# Altium schematic sheet MAX_SEG.SchDoc
size A; SheetNumber: 2; SheetTotal: 2
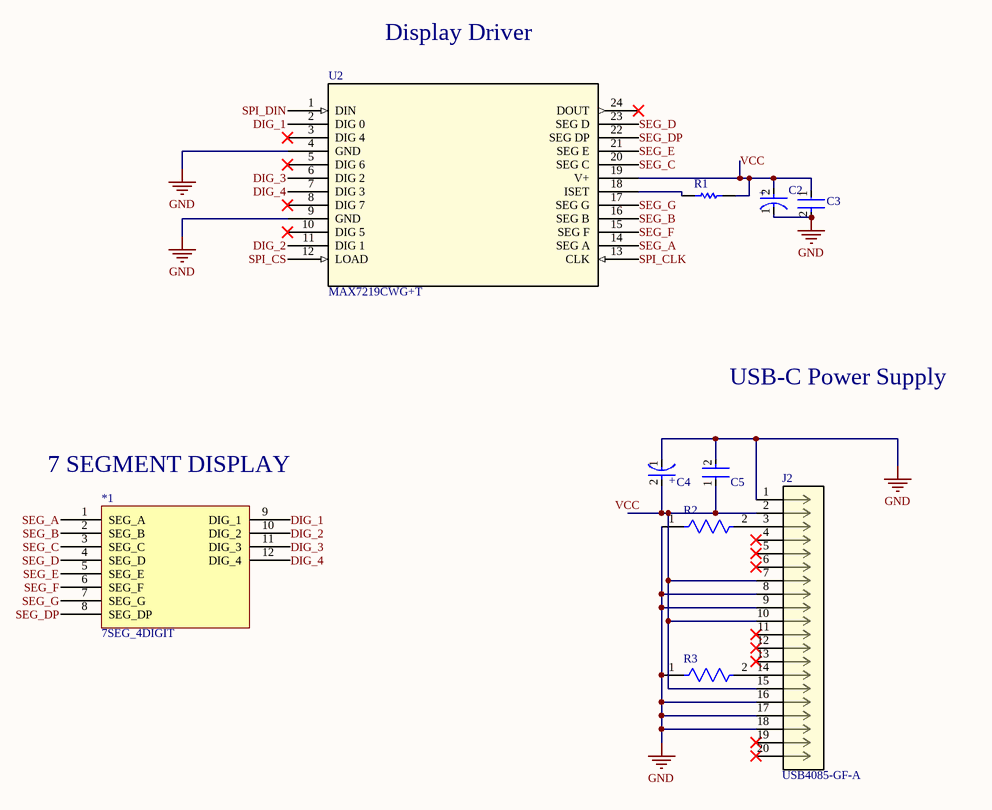
[diagram p0: MAX_SEG.SchDoc]

## Parts
*1  7SEG_4DIGIT  [PCBComponent_1]
C2  TAJB106K010RNJ  [FP-TAJB-MFG]  (value not drawn)
C3  GRM155R71C104KA88D  [FP-GRM15-MFG]  (value not drawn)
C4  TAJB106K010RNJ  [FP-TAJB-MFG]  (value not drawn)
C5  GRM155R71C104KA88D  [FP-GRM15-MFG]  (value not drawn)
J2  USB4085-GF-A  [CONN16_USB4085-GF-A_GCT]
R1  RC0402FR-0710KL  [RESC1005X40X25LL05T10]  (value not drawn)
R2  RN73R1ETTP5101F25  [FP-RN73R1E-IPC_C]  (value not drawn)
R3  RN73R1ETTP5101F25  [FP-RN73R1E-IPC_C]  (value not drawn)
U2  MAX7219CWG+T  [21-0042B_24_MXM]

## Nets
GND: C2.1(C) C3.2 C4.1(C) C5.2 J2.1 J2.8 J2.9 J2.16 J2.17 J2.18 R2.1 R3.1 U2.4(GND) U2.9(GND)
DIG_1: *1.9(DIG_1) U2.2(DIG_0)
DIG_2: *1.10(DIG_2) U2.11(DIG_1)
DIG_3: *1.11(DIG_3) U2.6(DIG_2)
DIG_4: *1.12(DIG_4) U2.7(DIG_3)
SEG_A: *1.1(SEG_A) U2.14(SEG_A)
SEG_B: *1.2(SEG_B) U2.16(SEG_B)
SEG_C: *1.3(SEG_C) U2.20(SEG_C)
SEG_D: *1.4(SEG_D) U2.23(SEG_D)
SEG_DP: *1.8(SEG_DP) U2.22(SEG_DP)
SEG_E: *1.5(SEG_E) U2.21(SEG_E)
SEG_F: *1.6(SEG_F) U2.15(SEG_F)
SEG_G: *1.7(SEG_G) U2.17(SEG_G)
SPI_CLK: U2.13(CLK)
SPI_CS: U2.12(LOAD)
SPI_DIN: U2.1(DIN)
VCC: C2.2(A) C3.1 C4.2(A) C5.1 J2.2 J2.7 J2.10 J2.15 R1.2 U2.19(V+)
NetJ2_3: J2.3 R2.2
NetJ2_14: J2.14 R3.2
NetR1_1: R1.1 U2.18(ISET)

Not connected (* = marked no-connect by the designer): J2 4* 5* 6* 11* 12* 13* 19* 20*; U2 3(DIG_4)* 5(DIG_6)* 8(DIG_7)* 10(DIG_5)* 24(DOUT)*

## Notes on the sheet
- Display Driver
- USB-C Power Supply
- (near *1) 7 SEGMENT DISPLAY
- (in symbol CMP-04424-000573-1) +

## Library data of the parts
*1 = 7SEG_4DIGIT: 4 Digit 7 Segment Common Cathode Display
C2 C4 = CMP-04424-000573-1: 10uF 10V  ±10% 2.1Ω 1210  SMD Tantalum Capacitor; ESR (Equivalent Series Resistance): 2.5R; Q Factor: 6; Dissipation Factor: 6%; Leakage Current: 1uA; Polarity: Polar; RoHS Compliant: Yes; Mount: Surface Mount; Capacitance: 10uF; Voltage Rating: 10V; Width: 2.8mm; Dielectric Material: Tantalum; Tolerance: 10%; Case/Package: 1210; Termination: SMD/SMT; Length: 3.5mm; REACH SVHC: No SVHC; Packaging: Tape and Reel; Radiation Hardening: No; Lead Free: Lead Free; Min Operating Temperature: -55°C; Package Quantity: 2000; Series: TAJ; Voltage Rating (DC): 10V; Features: General Purpose; Height: 1.9mm; Height - Seated (Max): 0.083inch; Depth: 2.8mm; Case Code (Imperial): 1210; Case Code (Metric): 3528; Voltage: 10V; Max Operating Temperature: 125°C
C3 C5 = CMP-2100-03641-2: CAP CER 0.1UF 16V X7R 0402; Manufacturer: Murata; Standoff Height: 0mm; Tolerance: 10%; Voltage Rating: 16Vdc; Material: Ceramic; Capacitance: 0.10μF; Value: 0.10μF; RoHS: TRUE; Manufacturer Part Number: GRM155R71C104KA88D; Temperature Characteristic: X7R; Octopart: https://octopart.com/grm155r71c104ka88d-murata-196880; Digikey Description: CAP CER 0.1UF 16V X7R 0402; Device Class L3: Ceramic Capacitors; Height: 0.55mm; ComponentLink2Description: Datasheet; Temperature Range Low: -55°C; Ipc Land Pattern Name: CAPC10050X219; ComponentLink2URL: https://search.murata.co.jp/Ceramy/image/img/A01X/G101/ENG/GRM155R71H471KA01-01A.pdf; Device Class L1: Passive Components; Lead Free: yes; Category: Cap; Package: GRM15; Temperature: -55°C to +125°C; Device Class L2: Capacitors; Temperature Range High: +125°C; Mouser Description: 0402 0.1 uF 16V ±10 % Tolerance X7R SMT Multilayer Ceramic Capacitor
J2 = USB4085-GF-A: Description; Manufacturer_Name: Global Connector Technology; Copyright: Copyright (C) 2025 Ultra Librarian. All rights reserved.; Manufacturer_Part_Number: USB4085-GF-A; RefDes: RefDes; Type: Type
R1 = CMP-2002-07353-1: Manufacturer: Yageo / Phycomp; Part Number: RC0402FR-0710KL
R2 R3 = CMP-04015-008529-1: 5.1kΩ ±1% 0.063W, 1/16W Chip Resistor 0402 (1005 Metric) Moisture Resistant Thin Film
U2 = MAX7219CWG+T: Serially Interfaced, 8-Digit, LED Display Drivers; Manufacturer_Name: Analog Devices Inc; Copyright: Copyright (C) 2026 Ultra Librarian. All rights reserved.; Manufacturer_Part_Number: MAX7219CWG+T; RefDes: RefDes; Type: Type